# Altium schematic sheet SWD.SchDoc
size A; SheetNumber: 7; SheetTotal: 15
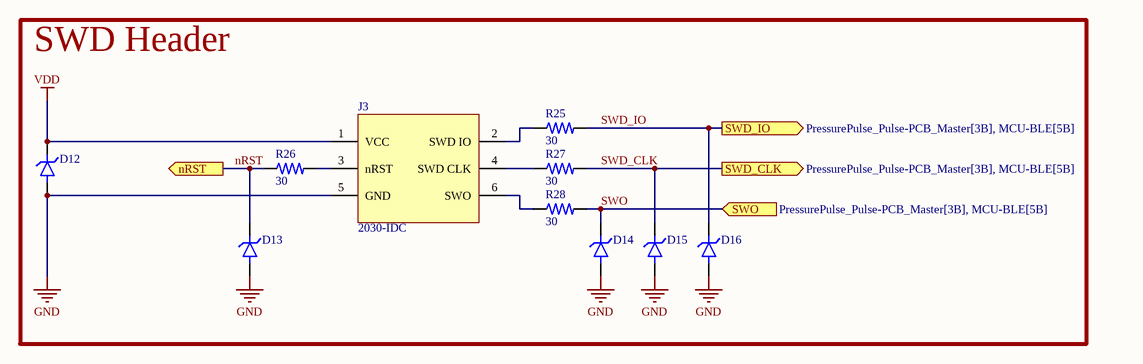
[diagram p0: SWD.SchDoc]

## Parts
D12  RCLAMP0521P.TCT  [BDFN2C051V40]  (value not drawn)
D13  RCLAMP0521P.TCT  [BDFN2C051V40]  (value not drawn)
D14  RCLAMP0521P.TCT  [BDFN2C051V40]  (value not drawn)
D15  RCLAMP0521P.TCT  [BDFN2C051V40]  (value not drawn)
D16  RCLAMP0521P.TCT  [BDFN2C051V40]  (value not drawn)
J3  2030-IDC  [TAG CONNECT TC2030IDC - NO 3D MODEL]
R25  value 30  [0402R]  (hidden comment: RES)
R26  value 30  [0402R]  (hidden comment: RES)
R27  value 30  [0402R]  (hidden comment: RES)
R28  value 30  [0402R]  (hidden comment: RES)

## Blocks framed on the sheet
SWD Header: D12-D16 J3 R25-R28

## Ports
nRST (out, see PressurePulse_Pulse-PCB_Master[3B], MCU-BLE[4C]), SWD_CLK (out, see PressurePulse_Pulse-PCB_Master[3B], MCU-BLE[5B]), SWD_IO (out, see PressurePulse_Pulse-PCB_Master[3B], MCU-BLE[5B]), SWO (in, see PressurePulse_Pulse-PCB_Master[3B], MCU-BLE[5B])

## Nets
GND: D12.A D13.A D14.A D15.A D16.A J3.5(GND)
VDD: D12.K J3.1(VCC)
nRST: D13.K R26.1 ; port nRST
SWD_CLK: D15.K R27.2 ; port SWD_CLK
SWD_IO: D16.K R25.2 ; port SWD_IO
SWO: D14.K R28.2 ; port SWO
NetJ3_2: J3.2(SWD_IO) R25.1
NetJ3_3: J3.3(nRST) R26.2
NetJ3_4: J3.4(SWD_CLK) R27.1
NetJ3_6: J3.6(SWO) R28.1

## Library data of the parts
D12-D16 = TVS DIODE: 25V Clamp 4A (8/20µs) Ipp Tvs Diode Surface Mount SLP1006P2; MFR: BORN; Type: SMD; Value: BDFN2C051V40; MFR PN: BDFN2C051V40; JLCPCB PN: C152023
J3 = TAG CONNECT 2030-IDC: MFR PN: TC2030-IDC; Value: DNS; MFR: Tag Connect
R25-R28 = RES: Resistor; MFR PN: *; MFR: *; JLCPCB PN: *